# EAGLE design jnusb_v10 (EAGLE 5.11)

## Sheet 1 of 2
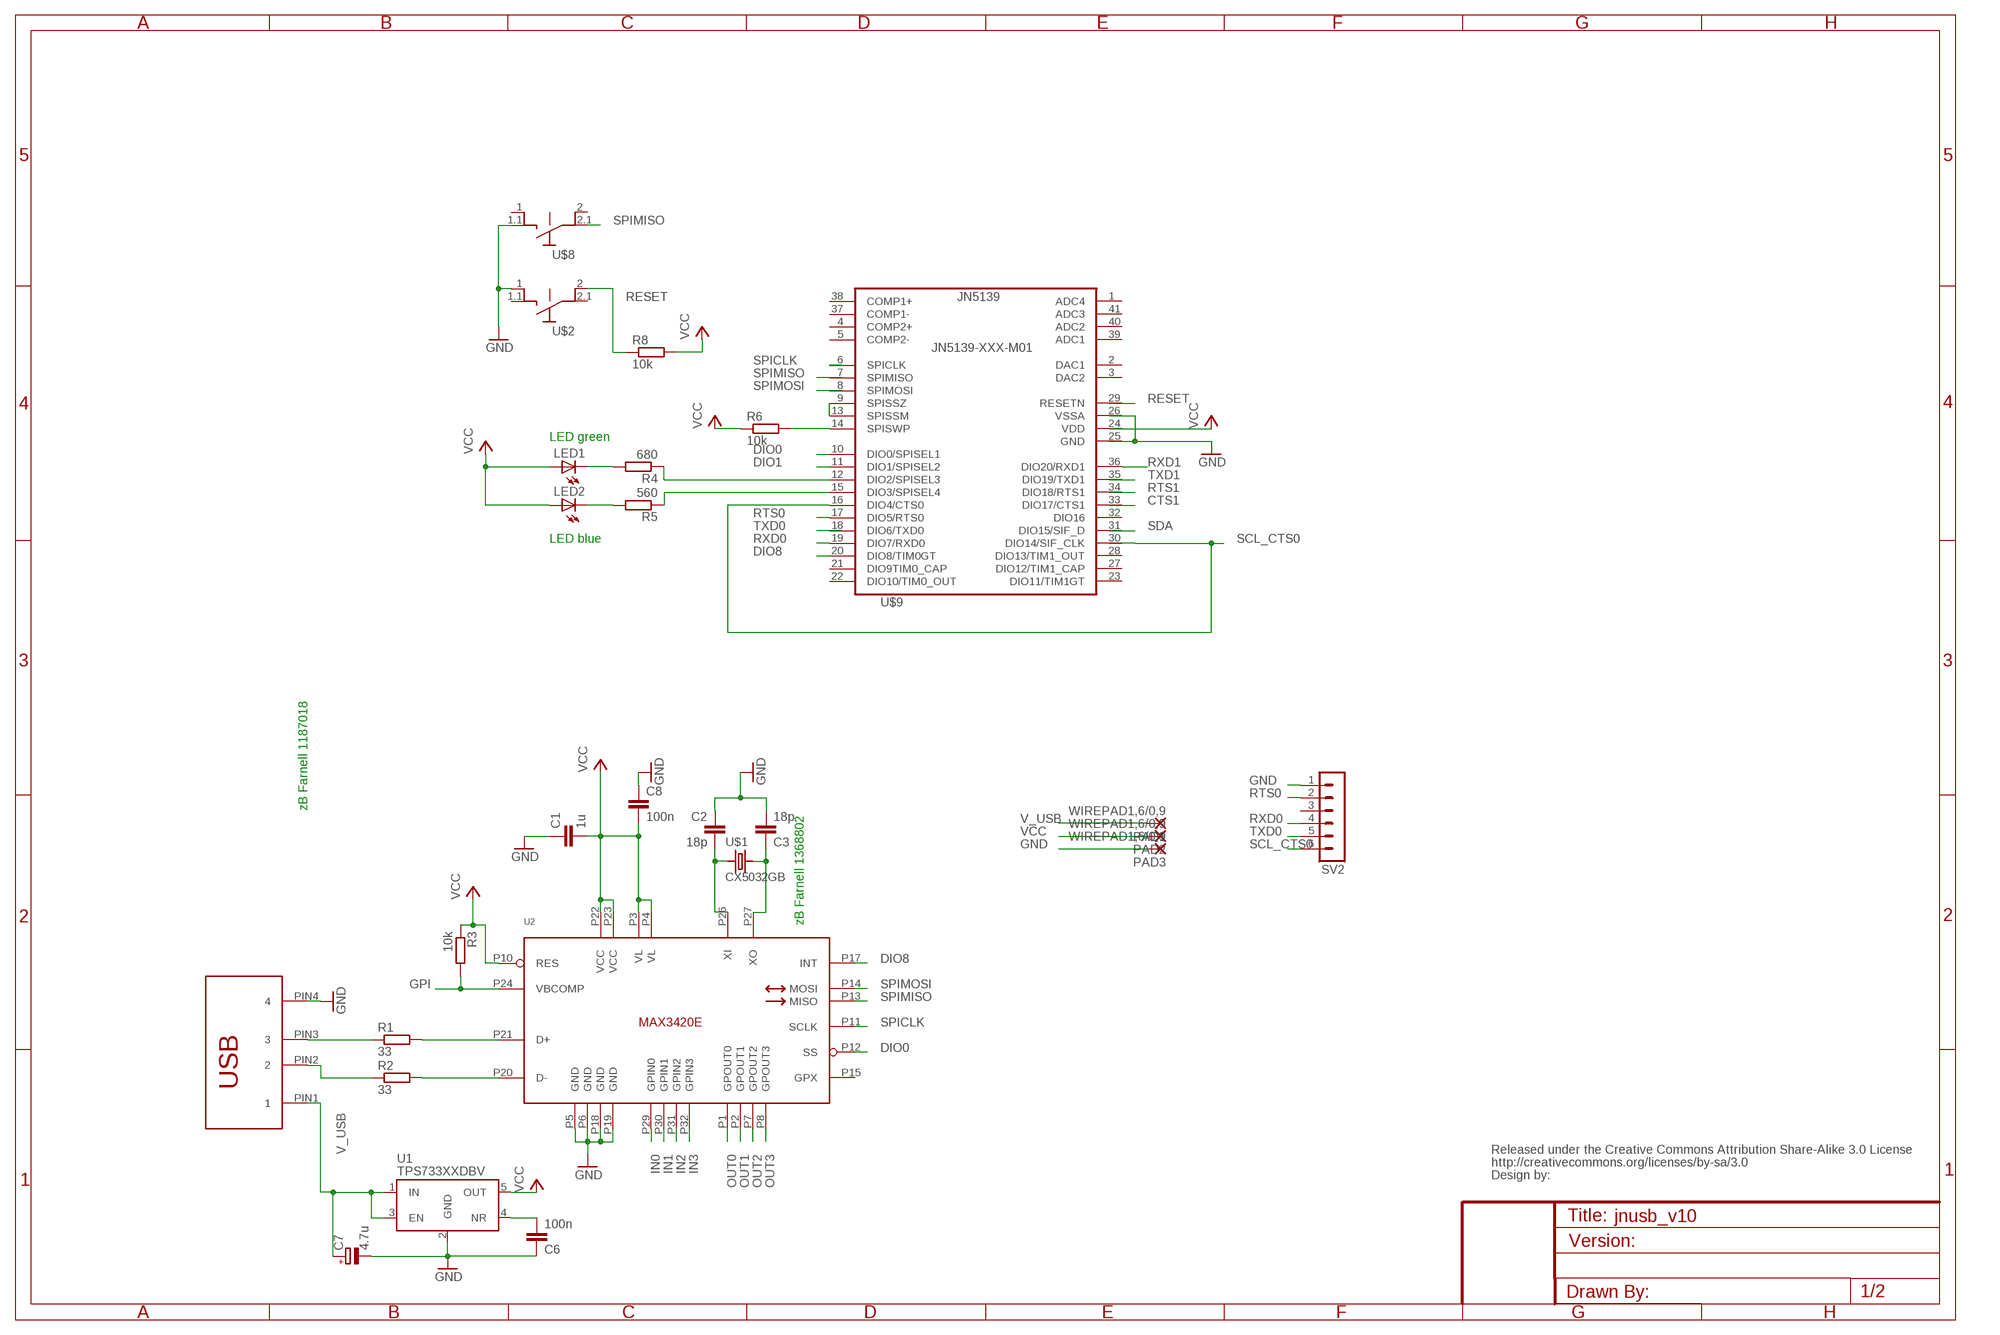
[diagram p0: schematic, sheet 1]

### Parts
C1  1u  C-EUC0603K  [C0603K]
C2  18p  C-EUC0603K  [C0603K]
C3  18p  C-EUC0603K  [C0603K]
C6  100n  C-EUC0603K  [C0603K]
C7  4.7u  CPOL-EU153CLV-0505  [153CLV-0505]
C8  100n  C-EUC0603K  [C0603K]
LED1  LEDCHIP-LED0603  [CHIP-LED0603]
LED2  LEDCHIP-LED0603  [CHIP-LED0603]
PAD1  WIREPAD1,6/0,9  [1,6/0,9]
PAD2  WIREPAD1,6/0,9  [1,6/0,9]
PAD3  WIREPAD1,6/0,9  [1,6/0,9]
R1  33  R-EU_R0603  [R0603]
R2  33  R-EU_R0603  [R0603]
R3  10k  R-EU_R0603  [R0603]
R4  680  R-EU_R0603  [R0603]
R5  560  R-EU_R0603  [R0603]
R6  10k  R-EU_R0603  [R0603]
R8  10k  R-EU_R0603  [R0603]
SV2  MA06-1  [MA06-1]
U1  TPS733XXDBV  [SOT23-5]
U2  MAX3420ELQFP32  [LQFP32]
U$1  CX5032GB  [CX-53F]
U$2  MICRO-SWITCHG  [KMS2XX]
U$3  CREATIVE_COMMONS  [CREATIVE_COMMONS]
U$5  2410  [2410]
U$8  MICRO-SWITCHG  [KMS2XX]
U$9  JN5139-XXX-M01  [JN5139-XXX-MO0]

### Nets
CTS1: U$9.33(DIO17/CTS1)
DIO0: U2.P12(SS) U$9.10(DIO0/SPISEL1)
DIO1: U$9.11(DIO1/SPISEL2)
DIO2: R4.1 U$9.12(DIO2/SPISEL3)
DIO3: R5.1 U$9.15(DIO3/SPISEL4)
DIO8: U2.P17(INT) U$9.20(DIO8/TIM0GT)
GND: C1.1 C2.1 C3.2 C6.1 C7.- C8.1 PAD3.1(P) SV2.1 U1.2(GND) U2.P5(GND) U2.P6(GND) U2.P18(GND) U2.P19(GND) U$2.1 U$5.PIN4 U$8.1.1 U$9.25(GND) U$9.26(VSSA)
GPI: R3.2 U2.P24(VBCOMP)
IN0: U2.P29(GPIN0)
IN1: U2.P30(GPIN1)
IN2: U2.P31(GPIN2)
IN3: U2.P32(GPIN3)
N$1: R2.1 U$5.PIN2
N$2: R1.1 U$5.PIN3
N$3: R1.2 U2.P21(D+)
N$4: R2.2 U2.P20(D-)
N$5: LED1.C R4.2
N$6: C6.2 U1.4(NR)
N$7: LED2.C R5.2
N$8: C2.2 U2.P26(XI) U$1.P$2
N$9: U$9.9(SPISSZ) U$9.13(SPISSM)
N$10: C3.1 U2.P27(XO) U$1.P$1
N$14: R6.2 U$9.14(SPISWP)
OUT0: U2.P1(GPOUT0)
OUT1: U2.P2(GPOUT1)
OUT2: U2.P7(GPOUT2)
OUT3: U2.P8(GPOUT3)
RESET: R8.1 U$2.2 U$9.29(RESETN)
RTS0: SV2.2 U$9.17(DIO5/RTS0)
RTS1: U$9.34(DIO18/RTS1)
RXD0: SV2.4 U$9.19(DIO7/RXD0)
RXD1: U$9.36(DIO20/RXD1)
SCL_CTS0: SV2.6 U$9.16(DIO4/CTS0) U$9.30(DIO14/SIF_CLK)
SDA: U$9.31(DIO15/SIF_D)
SPICLK: U2.P11(SCLK) U$9.6(SPICLK)
SPIMISO: U2.P13(MISO) U$8.2.1 U$9.7(SPIMISO)
SPIMOSI: U2.P14(MOSI) U$9.8(SPIMOSI)
TXD0: SV2.5 U$9.18(DIO6/TXD0)
TXD1: U$9.35(DIO19/TXD1)
V_USB: C7.+ PAD1.1(P) U1.1(IN) U1.3(EN) U$5.PIN1
VCC: C1.2 C8.2 LED1.A LED2.A PAD2.1(P) R3.1 R6.1 R8.2 U1.5(OUT) U2.P3(VL) U2.P4(VL) U2.P10(RES) U2.P22(VCC) U2.P23(VCC) U$9.24(VDD)
Unconnected: SV2.3 U2.P15(GPX) U$2.1.1 U$2.2.1 U$2.GND U$8.1 U$8.2 U$8.GND U$9.1(ADC4) U$9.2(DAC1) U$9.3(DAC2) U$9.4(COMP2+) U$9.5(COMP2-) U$9.21(DIO9TIM0_CAP) U$9.22(DIO10/TIM0_OUT) U$9.23(DIO11/TIM1GT) U$9.27(DIO12/TIM1_CAP) U$9.28(DIO13/TIM1_OUT) U$9.32(DIO16) U$9.37(COMP1-) U$9.38(COMP1+) U$9.39(ADC1) U$9.40(ADC2) U$9.41(ADC3)

### Notes on the sheet
- LED green
- LED blue
- zB Farnell 1187018
- zB Farnell 1368802

## Sheet 2 of 2

## Library data of the parts
C1-C3 C6 C8 = rcl:C-EU: CAPACITOR, European symbol
C7 = rcl:CPOL-EU: POLARIZED CAPACITOR, European symbol
LED1 LED2 = led:LED: LED OSRAM: - CHIPLED LG R971, LG N971, LY N971, LG Q971, LY Q971, LO R971, LY R971 LH N974, LH R974 LS Q976, LO Q976, LY Q976 LO Q996 - Hyper CHIPLED LW Q18S LB Q993, LB Q99A, LB R99A - SideLED LS A670, LO A670, LY A670, LG A670, LP A670 LB A673, LV A673, LT A673, LW A673 LH A674 LY A675 LS A676, LA A676, LO A676, LY A676, LW A676 LS A679, LY A679, LG A679 - Hyper Micro SIDELED® LS Y876, LA Y876, LO Y876, LY Y876 LT Y87S - SmartLED LW L88C, LW L88S LB L89C, LB L89S, LG L890 LS L89K, LO L89K, LY L89K LS L896, LA L896, LO L896, LY L896 - TOPLED LS T670, LO T670, LY T670, LG T670, LP T670 LSG T670, LSP T670, LSY T670, LOP T670, LYG T670 LG T671, LOG T671, LSG T671 LB T673, LV T673, LT T673, LW T673 LH T674 LS T676, LA T676, LO T676, LY T676, LB T676, LH T676, LSB T676, LW T676 LB T67C, LV T67C, LT T67C, LS T67K, LO T67K, LY T67K, LW E67C LS E67B, LA E67B, LO E67B, LY E67B, LB E67C, LV E67C, LT E67C LW T67C LS T679, LY T679, LG T679 LS T770, LO T770, LY T770, LG T770, LP T770 LB T773, LV T773, LT T773, LW T773 LH T774 LS E675, LA E675, LY E675, LS T675 LS T776, LA T776, LO T776, LY T776, LB T776 LHGB T686 LT T68C, LB T68C - Hyper Mini TOPLED® LB M676 - Mini TOPLED Santana® LG M470 LS M47K, LO M47K, LY M47K Source: http://www.osram.convergy.de/
PAD1-PAD3 = wirepad:WIREPAD: Wire PAD connect wire on PCB
R1-R6 R8 = rcl:R-EU_: RESISTOR, European symbol
SV2 = con-lstb:MA06-1: PIN HEADER
U1 = teco_ics:TPS733XX: ULTRALOW-NOISE, HIGH PSRR, FAST RF 200-mA LOW-DROPOUT LINEAR REGULATORS IN NANOSTAR WAFER CHIP SCALE AND SOT23 Farnell: 1207346
U2 = teco_ics:MAX3420E: MAXIM - MAX3420EECJ+ USB P/H CONTROLLER, SPI, 32LQFP Farnell Best.Nr.:1593354 USB P/H CONTROLLER, SPI, 32LQFP Treiber, IC-Typ:Controller Ausgänge, Zahl der:4 Spannung, Ausgang:4.3V Spannung, Versorgung min.:3V Gehäusetyp:LQFP Temperatur Arbeitsbereich:-40°C to +85°C Anschlussart:SMD Frequenz:26MHz Kanäle, Zahl der:4 Pin, Zahl der:32 Spannung, Versorgung max.:3.6V Temperatur, Betriebs- max.:85°C Temperatur, Betriebs- min.:-40°C
U$1 = teco_div:CX5032GB: Crystal CX-53F (CX5032GB) AVX - CX5032GB12000H0PESZZ - QUARZ, SM, CX-53F Farnell: 1368769 5 x 3.2mm SMD
U$2 U$8 = teco_switches:MICRO-SWITCH
U$3 = sparkfun:CREATIVE_COMMONS
U$5 = sonder_t:2410: USB A-Type Plug SMD Hersteller: Lumberg (www.lumberg.de) Bezug: Elcon (www.elcon-electronic.de)
U$9 = jennic:JN5139-XXX-M01: JN5139-xxx-M00xxx, Farnell: 1500175

## Board
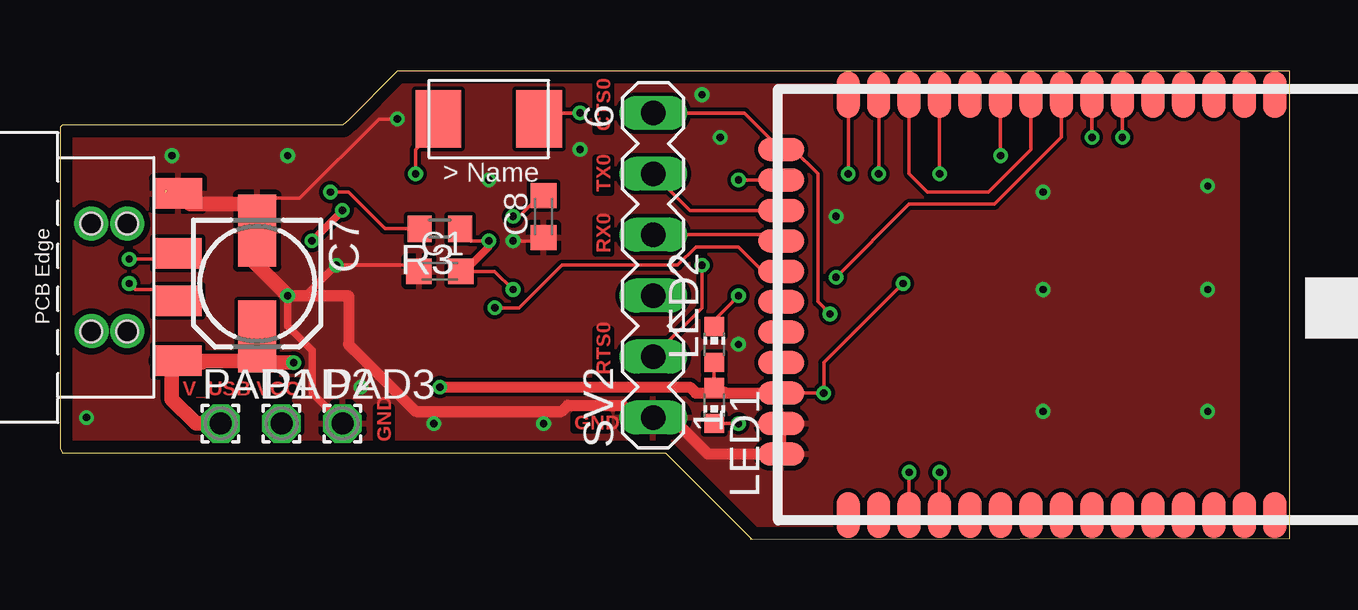
[diagram p1: board, top side]
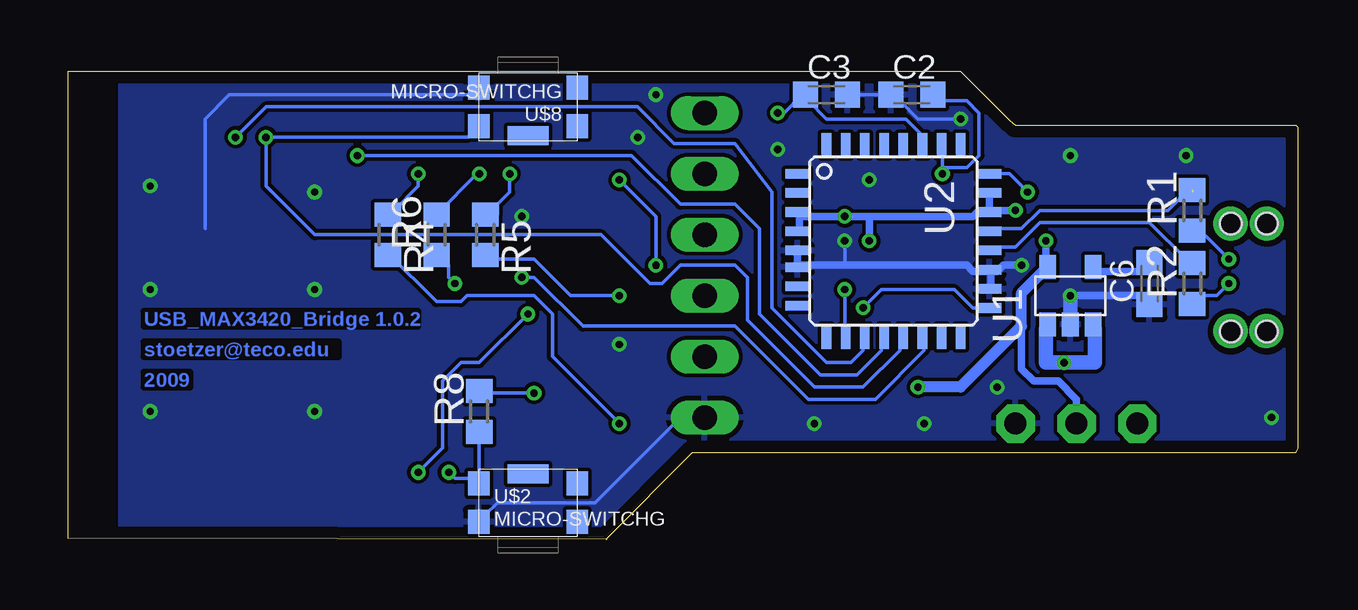
[diagram p2: board, bottom side, seen from below]

Size 51.26 x 19.52 mm. Coordinates in mm from the lower left corner, seen from the top.
Outline: 0,3.78 0.1,3.59 25.25,3.59 28.84,0 28.79,0 51.26,0.04 51.26,19.52 14.06,19.52 12.03,17.49 11.77,17.27 0.09,17.27 0,17.18 0,3.78
Copper layers (1*16): Top 0.035mm / dielectric 1.5mm / Bottom 0.035mm
Design rules "PCB-POOL": minimum track width 6mil, minimum drill 12mil, track to track 6mil, track to pad 6mil, pad to pad 6mil, via to via 6mil, smd to smd 6mil, copper to edge 20mil, drill to drill 8mil, minimum pad ring 8mil, minimum via ring 6mil, stop-mask expansion 3mil, vias tented up to drill 0mil, thermal gap 8mil

### Footprints (pad centres in the part's own frame; a part is rotated, then mirrored left to right if it is on the bottom)
C0603K = smd 1.05 x 1.08: 1 -0.875,0; 2 0.875,0
153CLV-0505 = smd 3 x 1.6: + 2.2,0; - -2.2,0
CHIP-LED0603 = smd 0.8 x 0.8: A 0,-0.75; C 0,0.75
1,6/0,9 = drill 0.914 pad 1.6 octagon: 1 0,0
R0603 = smd 1 x 1.1: 1 -0.85,0; 2 0.85,0
MA06-1 = drill 1.016 long: 1 -6.35,0; 2 -3.81,0; 3 -1.27,0; 4 1.27,0; 5 3.81,0; 6 6.35,0
SOT23-5 = smd 1 x 0.7: 1 -1.2,0.95; 2 -1.2,0; 3 -1.2,-0.95; 4 1.2,-0.95; 5 1.2,0.95
LQFP32 = smd 0.4 x 1: P1 -2.8,-4; P2 -2,-4; P3 -1.2,-4; P4 -0.4,-4; P5 0.4,-4; P6 1.1,-4; P7 1.9,-4; P8 2.7,-4; P17 2.8,4; P18 2,4; P19 1.2,4; P20 0.4,4; P21 -0.4,4; P22 -1.2,4; P23 -2,4; P24 -2.8,4 | smd 1 x 0.4: P9 4,-2.8; P10 4,-2; P11 4,-1.2; P12 4,-0.4; P13 4,0.4; P14 4,1.2; P15 4,2; P16 4,2.8; P25 -4,2.8; P26 -4,2; P27 -4,1.2; P28 -4,0.4; P29 -4,-0.4; P30 -4,-1.2; P31 -4,-2; P32 -4,-2.8
CX-53F = smd 1.9 x 2.4: P$1 -2.1,0; P$2 2.1,0
KMS2XX = smd 0.9 x 1: 1 -2.05,-0.8; 1.1 2.05,-0.8; 2 -2.05,0.8; 2.1 2.05,0.8 | smd 1.7 x 0.8: GND 0,1.2
2410 = drill 0.9 pad 1.422 round: P$2 -2.24,-1.6; P$3 2.24,-1.6; P$4 2.24,-3.09; P$5 -2.24,-3.11 | smd 1.27 x 2: PIN1 3.48,0.5; PIN2 0.98,0.5; PIN3 -1,0.5; PIN4 -3.5,0.51 | hole 0.9: 2.25,-1.6; -2.25,-1.6; 2.25,-3.1; -2.25,-3.1
JN5139-XXX-MO0 = smd 1.93 x 0.965: 1 0,0; 2 0,-1.27; 3 0,-2.54; 4 0,-3.81; 5 0,-5.08; 6 0,-6.35; 7 0,-7.62; 8 0,-8.89; 9 0,-10.16; 10 0,-11.43; 11 0,-12.7; 12 0,-13.97; 13 0,-15.24; 14 0,-16.51; 15 0,-17.78; 27 17.526,-17.78; 28 17.526,-16.51; 29 17.526,-15.24; 30 17.526,-13.97; 31 17.526,-12.7; 32 17.526,-11.43; 33 17.526,-10.16; 34 17.526,-8.89; 35 17.526,-7.62; 36 17.526,-6.35; 37 17.526,-5.08; 38 17.526,-3.81; 39 17.526,-2.54; 40 17.526,-1.27; 41 17.526,0 | smd 0.965 x 1.93: 16 2.286,-20.574; 17 3.556,-20.574; 18 4.826,-20.574; 19 6.096,-20.574; 20 7.366,-20.574; 21 8.636,-20.574; 22 9.906,-20.574; 23 11.176,-20.574; 24 12.446,-20.574; 25 13.716,-20.574; 26 14.986,-20.574

### Placement (x,y rotation side)
C1  15.84,11.18 0 top
C2  16.09,18.54 0 bottom
C3  19.65,18.54 0 bottom
C6  6.18,10.67 90 bottom
C7  8.22,10.67 270 top
C8  20.15,13.46 90 top
LED1  27.27,5.59 180 top
LED2  27.27,8.13 0 top
PAD1  6.69,4.83 0 top
PAD2  9.23,4.83 0 top
PAD3  11.77,4.83 0 top
R1  4.41,13.72 90 bottom
R2  4.41,10.67 90 bottom
R3  15.84,12.95 180 top
R4  37.94,12.7 270 bottom
R5  33.87,12.7 270 bottom
R6  35.9,12.7 90 bottom
R8  34.12,5.33 90 bottom
SV2  24.73,11.43 90 top
U1  9.49,10.16 90 bottom
U2  16.85,12.45 270 bottom
U$1  17.87,17.53 180 top
U$2  32.09,1.52 0 bottom
U$3  6.44,-8.89 0 top  (outside the outline)
U$5  4.41,10.92 270 top
U$8  32.09,18.03 180 bottom
U$9  50.64,18.54 270 top

### Tracks (layer width: path | path; a pad name or v marks a point on that pad's centre or on a via)
DIO0  (via drill 0.3)
  Top 0.152: v39.21,16 U$9.10
  Bottom 0.152: U2.P12 17.36,8.34 17.36,7.87 18.38,6.86 19.9,6.86 22.44,9.4 22.44,12.95 23.46,13.97 25.74,13.97 27.77,16 v39.21,16
DIO2  (via drill 0.3)
  Top 0.152: U$9.12 36.92,18.29 36.66,18.03 v36.66,15.24
  Bottom 0.152: R4.1 37.68,13.72 36.66,14.73 v36.66,15.24
DIO3  (via drill 0.3)
  Top 0.152: v32.86,15.24 U$9.15
  Bottom 0.152: R5.1 33.36,13.55 33.36,13.97 32.86,14.48 v32.86,15.24
DIO8  (via drill 0.3)
  Top 0.152: v18.12,9.65 19.14,9.65 20.92,11.43 25.74,11.43 26.5,12.19 28.28,12.19 29.3,11.18 U$9.20
  Bottom 0.152: U2.P17 | v18.12,9.65 17.36,10.41 14.31,10.41 13.55,9.65 U2.P17 | U2.P17 12.79,9.65
GND  (via drill 0.3)
  Top 0.152: 20.15,12.7 C8.1 20.15,12.45 v18.88,12.45 | 7.8,12.87 7.8,13.8 8.22,14.22 10,14.22 13.3,17.53 v14.06,17.53 | C1.1 14.71,11.43 v11.52,11.43
  Top 0.305: 7.71,13.97 7.96,13.46 7.71,12.95 C7.- 7.8,12.87 7.71,11.94 | v11.52,11.43 10.25,10.16 v9.49,10.16 9.49,8.89 10.5,7.87 10.5,6.1 PAD3.1
  Top 0.457: U$9.25 U$9.26 27.01,3.56 25.49,5.08 SV2.1 23.96,5.08 23.46,5.59 21.17,5.59 20.92,5.33 14.82,5.33 12.03,8.13 12.03,10.16 v9.49,10.16
  Top 0.61: v9.49,10.16 7.71,11.94 | 4.92,14.48 | 4.92,14.48 U$5.PIN4 | 7.71,13.97 5.42,13.97 4.92,14.48
  Bottom 0.152: 18.88,11.43 v18.88,12.45 | 25.23,4.83 24.98,4.83 SV2.1 25.74,5.08 29.3,1.52 33.36,1.52 33.87,1.02 33.87,1 U$2.1 | 45.55,12.95 45.55,17.53 44.54,18.54 34.38,18.54 34.38,18.6 U$8.1.1 | C2.1 16.85,18.54 | C2.1 C3.2 | C2.1 16.6,18.18 16.6,18.29 15.84,17.53 v14.06,17.53
  Bottom 0.305: C6.1 6.44,9.91 6.44,10.16 v9.49,10.16 | U2.P5 20.85,12 20.92,11.94 20.85,11.87 U2.P6 20.75,11.35 20.66,11.43 18.88,11.43 13.8,11.43 13.55,11.18 12.79,11.18 | v11.52,11.43 12.28,11.43 12.54,11.18 12.78,11.18 12.79,11.18 | U2.P18 12.82,10.41 12.79,10.41 12.79,11.18 | 12.79,11.18 | 12.79,11.18 U2.P19
  Bottom 0.61: v9.49,10.16 U1.2
  other vias: 21.68,16.26 9.49,16 20.15,4.83 4.66,16 40.98,14.48 47.84,14.73 40.98,10.41 47.84,10.41 40.98,5.33 15.58,4.83 12.54,6.35 17.87,14.99 28.28,8.13 1.1,5.08 26.76,18.54 32.35,13.46 27.52,16.76 47.84,5.33
  pour Top: -0.17,19.3 -0.17,0.25 49.11,0.25 49.11,19.3
  pour Bottom: -0.17,19.3 -0.17,0.25 49.11,0.25 49.11,19.3
GPI  (via drill 0.3)
  Top 0.152: v11.27,14.48 12.03,14.48 13.55,12.95 R3.2 15.07,12.95 14.96,12.84
  Bottom 0.152: U2.P24 12.03,15.24 v11.27,14.48
N$1  (via drill 0.3)
  Top 0.152: U$5.PIN2 4.62,9.94 4.15,10.41 3.14,10.41 v2.88,10.67
  Bottom 0.152: R2.1 4.41,9.91 4.15,10.16 3.39,10.16 v2.88,10.67
N$2  (via drill 0.3)
  Top 0.152: U$5.PIN3 4.15,11.92 4.15,11.68 v2.88,11.68
  Bottom 0.152: R1.1 4.41,12.7 3.9,12.7 v2.88,11.68
N$3  (1 unrouted)
  Bottom 0.152: U2.P21 12.93,12.85 13.04,12.95 11.52,12.95 10.76,13.72 5.42,13.72 4.66,14.48 4.41,14.48
N$4
  Bottom 0.152: U2.P20 12.68,12.05 12.54,12.19 11.77,12.19 10.76,13.21 6.18,13.21 4.66,11.68 4.41,11.68 R2.2
N$5  (via drill 0.3)
  Top 0.152: LED1.C 27.53,4.83 v28.28,4.83
  Bottom 0.152: v28.28,4.83 31.08,7.62 31.08,9.4 31.84,10.16 34.63,10.16 34.89,9.91 35.9,9.91 37.94,11.94 R4.2 37.68,11.94
N$6
  Bottom 0.305: U1.4 8.47,11.29 8.47,11.18 6.33,11.18 C6.2
N$7  (via drill 0.3)
  Top 0.152: v28.28,10.16 27.77,9.65 27.27,9.13 LED2.C
  Bottom 0.152: R5.2 33.53,11.85 33.36,11.68 31.84,11.68 30.31,10.16 v28.28,10.16
N$8  (via drill 0.3)
  Top 0.152: U$1.P$2 15.07,16.83 15.07,16.51 14.82,16.26 v14.82,15.24
  Bottom 0.152: 14.82,15.49 13.8,15.49 13.3,16 13.3,17.78 13.8,18.29 14.96,18.29 C2.2 15.07,18.54 | 14.82,16.48 14.82,16.51 | 14.82,16.48 U2.P26 | 14.82,15.49 14.82,16.48 | v14.82,15.24 14.82,15.49
N$9
  Top 0.152: U$9.13 35.4,15.24 36.16,14.48 38.7,14.48 40.48,16.26 U$9.9
N$10  (via drill 0.3)
  Top 0.152: U$1.P$1 20.22,17.78 v21.68,17.78
  Bottom 0.152: v21.68,17.78 21.43,17.78 20.66,18.54 C3.1 20.41,18.54 20.41,18.29 19.65,17.53 16.34,17.53 15.58,16.76 15.58,16.51 15.59,16.51 U2.P27
N$14  (via drill 0.3)
  Top 0.152: U$9.14 34.38,18.29 34.12,18.29 v34.12,15.24
  Bottom 0.152: R6.2 34.21,15.24 v34.12,15.24
RESET  (via drill 0.3)
  Top 0.152: v35.4,2.79 U$9.29
  Bottom 0.152: U$2.2 34.16,2.32 34.38,2.54 35.14,2.54 v35.4,2.79 | U$2.2 34.09,2.32 33.87,2.54 | U$2.2 34.14,2.52 34.12,2.54 R8.1
RTS0  (via drill 0.3)
  Top 0.152: SV2.2 26.76,9.65 v26.76,11.43 | v28.28,14.99 U$9.17
  Bottom 0.152: v26.76,11.43 26.76,13.46 v28.28,14.99
RXD0
  Top 0.152: U$9.19 29.55,12.45 29.3,12.7 SV2.4
SCL_CTS0  (via drill 0.3)
  Top 0.152: SV2.6 28.54,17.78 U$9.16 30.57,16.26 31.58,15.24 31.58,9.91 v32.09,9.4 | U$9.30 v36.66,2.79
  Bottom 0.152: v36.66,2.79 35.65,3.81 35.65,6.6 34.89,7.37 34.12,7.37 v32.09,9.4
SPICLK  (via drill 0.3)
  Top 0.152: v44.29,16.76 U$9.6
  Bottom 0.152: U2.P11 18.12,8.38 18.12,7.87 18.63,7.37 19.65,7.37 21.93,9.65 21.93,14.48 23.46,16.51 26,16.51 27.52,18.03 43.02,18.03 v44.29,16.76
SPIMISO  (via drill 0.3)
  Top 0.152: v43.02,16.76 U$9.7
  Bottom 0.152: 16.34,8.55 U2.P13 16.6,8.3 16.6,7.87 18.12,6.35 20.15,6.35 22.95,9.14 22.95,10.92 23.46,11.43 25.74,11.43 26.5,10.67 27.01,10.67 29.04,12.7 40.98,12.7 43.02,14.73 v43.02,16.76 34.61,16.76 U$8.2.1
SPIMOSI  (via drill 0.3)
  Top 0.152: U$9.8 41.75,16.76 38.95,13.97 35.4,13.97 v32.35,10.92
  Bottom 0.152: U2.P14 15.58,8.38 15.58,7.87 17.61,5.84 20.41,5.84 23.46,8.89 29.81,8.89 31.84,10.92 v32.35,10.92
TXD0
  Top 0.152: SV2.5 26.25,13.72 U$9.18
V_USB  (via drill 0.3)
  Top 0.305: 4.15,7.44 U$5.PIN1 | 7.71,7.44 7.71,8.38
  Top 0.61: 7.71,8.38 8.02,7.68 | 7.71,8.38 7.71,7.87 8.22,7.37 v9.74,7.37 | 7.71,8.38 C7.+ | 5.93,7.37 4.23,7.37 4.15,7.44 4.66,6.93 4.66,5.84 5.68,4.83 PAD1.1 | U$5.PIN1 7.71,7.44
  Bottom 0.305: 8.47,8.77 U1.3 | 10.5,8.77 U1.1 | 8.47,8.89 | U1.3 8.47,8.89 | 8.47,8.89 8.47,9.14 | U1.3 8.54,8.7
  Bottom 0.61: 8.47,8.77 8.47,7.37 v9.74,7.37 10.5,7.37 10.5,8.77
VCC  (via drill 0.3)
  Top 0.152: 16.85,12.7 16.69,12.87 R3.1 16.6,12.95 17.11,12.45 v17.87,12.45 | 16.6,11.18 C1.2 18.12,11.18 v18.88,10.41 | v18.88,13.46 19.14,13.46 19.9,14.22 20.04,14.22 C8.2 | LED1.A LED2.A | v35.14,10.67 31.84,7.37 v31.84,6.1 U$9.24
  Top 0.305: v10.5,12.45 v11.77,13.72 | v17.87,12.45 17.87,12.19 16.85,11.18 C1.2
  Top 0.457: v15.84,6.35 26.25,6.35 26.5,6.1 27.76,6.1 LED1.A 27.79,6.1 U$9.24
  Bottom 0.152: U2.P3 20.59,13.65 20.41,13.46 | U2.P10 18.85,8.41 18.88,8.38 v18.88,10.41 | R8.2 34.12,6.1 v31.84,6.1 | v35.14,10.67 35.4,10.92 35.4,11.43 35.9,11.94 | 35.9,11.94 R6.1 | 35.9,11.94 36.16,11.94
  Bottom 0.305: U1.5 10.5,11.43 v10.5,12.45 | U2.P22 12.61,13.65 12.54,13.72 v11.77,13.72 | U2.P22 12.79,13.72 12.85,13.78 U2.P23 | U2.P22 13.37,13.65 13.55,13.46 17.87,13.46 | U2.P4 20.77,12.85 20.77,13.35 20.66,13.46 | 20.66,13.46 U2.P3 20.48,13.65 20.66,13.46 | 17.87,13.46 v18.88,13.46 20.41,13.46 20.66,13.46 | 17.87,13.46 v17.87,12.45 | 11.52,8.89 11.52,7.11 11.01,6.6 10,6.6 9.23,5.84 PAD2.1
  Bottom 0.457: U1.5 11.52,10.28 11.52,8.89 14.06,6.35 v15.84,6.35

### Text on the board
Top: CTS0 | TX0 | RX0 | RTS0 | V_USB | VCC | GND | GND
Bottom: USB_MAX3420_Bridge 1.0.2 | stoetzer@teco.edu | 2009